# Altium schematic sheet PERIPHERALS.SchDoc
size A3; SheetNumber: 2; SheetTotal: 4
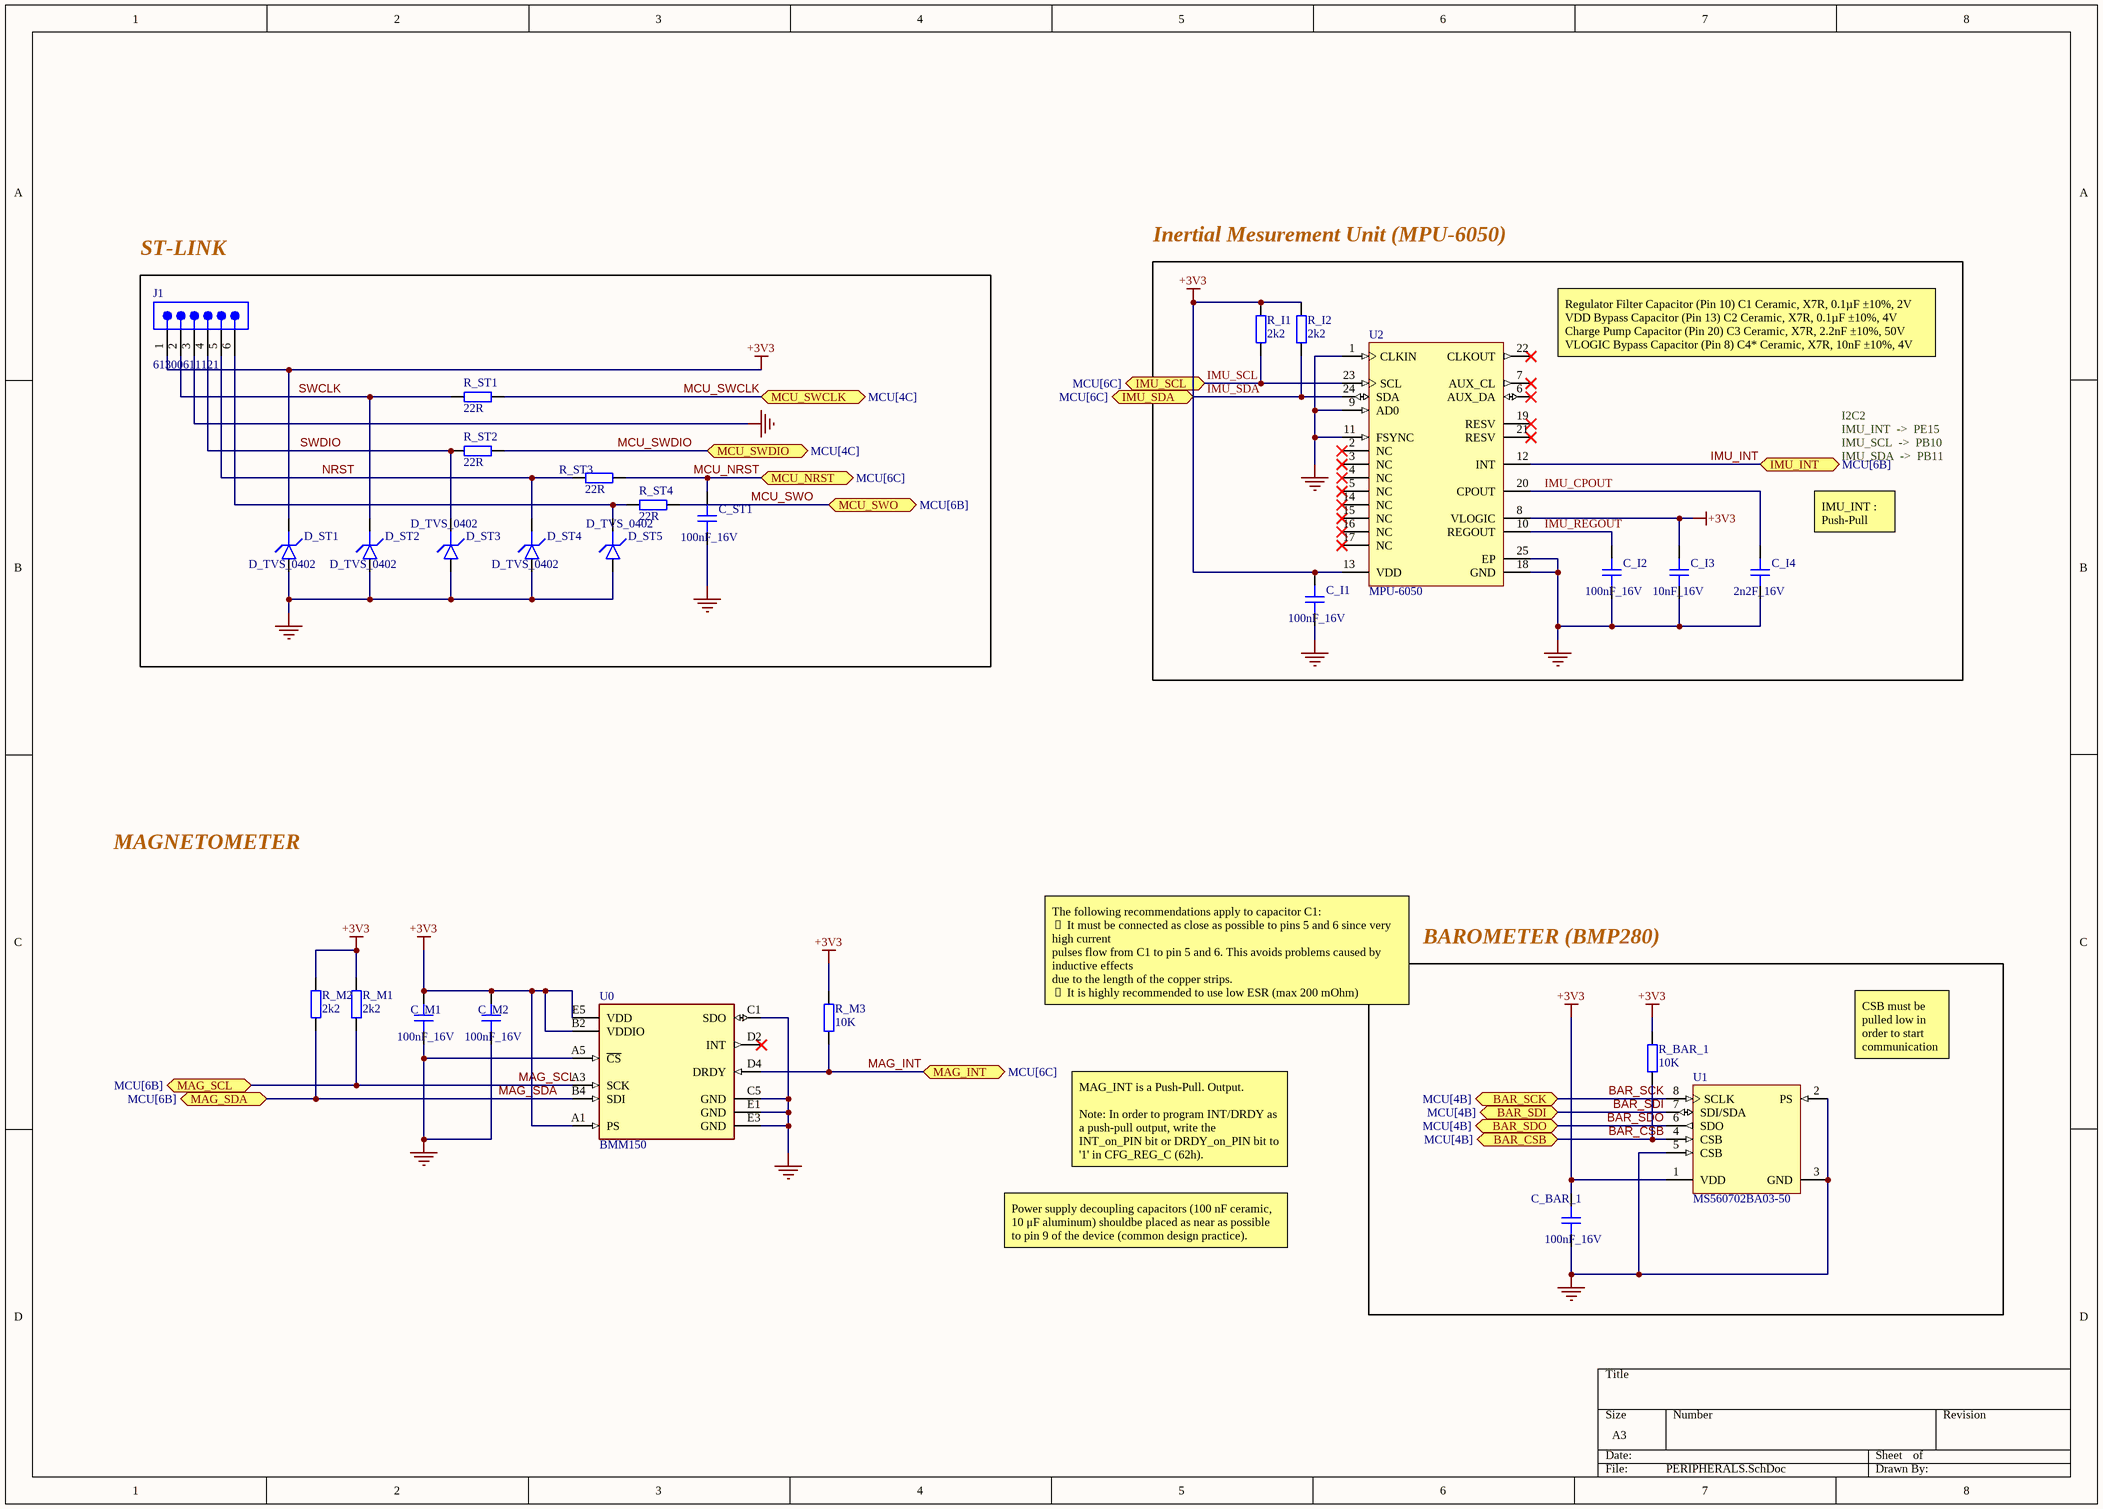
[diagram p0: PERIPHERALS.SchDoc]

## Parts
C_BAR_1  100nF_16V  [CAP_0402]
C_I1  100nF_16V  [CAP_0402]
C_I2  100nF_16V  [CAP_0402]
C_I3  10nF_16V  [CAP_0402]
C_I4  2n2F_16V  [CAP_0402]
C_M1  100nF_16V  [CAP_0402]
C_M2  100nF_16V  [CAP_0402]
C_ST1  100nF_16V  [CAP_0402]
D_ST1  D_TVS_0402  [D_0402]
D_ST2  D_TVS_0402  [D_0402]
D_ST3  D_TVS_0402  [D_0402]
D_ST4  D_TVS_0402  [D_0402]
D_ST5  D_TVS_0402  [D_0402]
J1  61300611121  [61300611121]
R_BAR_1  10K  [RES_0402]
R_I1  2k2  [RES_0402]
R_I2  2k2  [RES_0402]
R_M1  2k2  [RES_0402]
R_M2  2k2  [RES_0402]
R_M3  10K  [RES_0402]
R_ST1  22R  [RES_0402]
R_ST2  22R  [RES_0402]
R_ST3  22R  [RES_0402]
R_ST4  22R  [RES_0402]
U0  BMM150  [FP-BMM150-MFG]
U1  MS560702BA03-50  [TECO-MS560702BA03-50_V]
U2  MPU-6050  [IS-QFN-24_V]

## Blocks framed on the sheet
ST-LINK: C_ST1 D_ST1-D_ST5 J1 R_ST1-R_ST4
Inertial Mesurement Unit (MPU-6050): C_I1-C_I4 R_I1 R_I2 U2
BAROMETER (BMP280): C_BAR_1 R_BAR_1 U1

## Ports
BAR_CSB (bidir, see MCU[4B]), BAR_SCK (bidir, see MCU[4B]), BAR_SDI (bidir, see MCU[4B]), BAR_SDO (bidir, see MCU[4B]), IMU_INT (bidir, see MCU[6B]), IMU_SCL (bidir, see MCU[6C]), IMU_SDA (bidir, see MCU[6C]), MAG_INT (bidir, see MCU[6C]), MAG_SCL (bidir, see MCU[6B]), MAG_SDA (bidir, see MCU[6B]), MCU_NRST (bidir, see MCU[6C]), MCU_SWCLK (bidir, see MCU[4C]), MCU_SWDIO (bidir, see MCU[4C]), MCU_SWO (bidir, see MCU[6B])

## Nets
+3V3: C_BAR_1.2 C_I1.2 C_I3.2 C_M1.2 C_M2.2 D_ST1.K J1.1 R_BAR_1.1 R_I1.2 R_I2.2 R_M1.2 R_M2.2 R_M3.1 U0.A1(PS) U0.B2(VDDIO) U0.E5(VDD) U1.1(VDD) U2.8(VLOGIC) U2.13(VDD)
GND: C_BAR_1.1 C_I1.1 C_I2.1 C_I3.1 C_I4.1 C_M1.1 C_M2.1 C_ST1.1 D_ST1.A D_ST2.A D_ST3.A D_ST4.A D_ST5.A J1.3 U0.A5(~{CS}) U0.C1(SDO) U0.C5(GND) U0.E1(GND) U0.E3(GND) U1.2(PS) U1.3(GND) U1.5(CSB) U2.1(CLKIN) U2.9(AD0) U2.11(FSYNC) U2.18(GND) U2.25(EP)
BAR_CSB: R_BAR_1.2 U1.4(CSB) ; port BAR_CSB
BAR_SCK: U1.8(SCLK) ; port BAR_SCK
BAR_SDI: U1.7(SDI/SDA) ; port BAR_SDI
BAR_SDO: U1.6(SDO) ; port BAR_SDO
IMU_CPOUT: C_I4.2 U2.20(CPOUT)
IMU_INT: U2.12(INT) ; port IMU_INT
IMU_REGOUT: C_I2.2 U2.10(REGOUT)
IMU_SCL: R_I1.1 U2.23(SCL) ; port IMU_SCL
IMU_SDA: R_I2.1 U2.24(SDA) ; port IMU_SDA
MAG_INT: R_M3.2 U0.D4(DRDY) ; port MAG_INT
MAG_SCL: R_M1.1 U0.A3(SCK) ; port MAG_SCL
MAG_SDA: R_M2.1 U0.B4(SDI) ; port MAG_SDA
MCU_NRST: C_ST1.2 R_ST3.2 ; port MCU_NRST
MCU_SWCLK: R_ST1.2 ; port MCU_SWCLK
MCU_SWDIO: R_ST2.2 ; port MCU_SWDIO
MCU_SWO: R_ST4.2 ; port MCU_SWO
NRST: D_ST4.K J1.5 R_ST3.1
SWCLK: D_ST2.K J1.2 R_ST1.1
SWDIO: D_ST3.K J1.4 R_ST2.1
NetD_ST5_K: D_ST5.K J1.6 R_ST4.1

Not connected (* = marked no-connect by the designer): U0 D2(INT)*; U2 2(NC)* 3(NC)* 4(NC)* 5(NC)* 6(AUX_DA)* 7(AUX_CL)* 14(NC)* 15(NC)* 16(NC)* 17(NC)* 19(RESV)* 21(RESV)* 22(CLKOUT)*

## Notes on the sheet
- Regulator Filter Capacitor (Pin 10) C1 Ceramic, X7R, 0.1µF ±10%, 2V
  VDD Bypass Capacitor (Pin 13) C2 Ceramic, X7R, 0.1µF ±10%, 4V
  Charge Pump Capacitor (Pin 20) C3 Ceramic, X7R, 2.2nF ±10%, 50V
  VLOGIC Bypass Capacitor (Pin 8) C4* Ceramic, X7R, 10nF ±10%, 4V
- I2C2
- IMU_INT  ->  PE15
- IMU_SCL  ->  PB10
- IMU_SDA  ->  PB11
- IMU_INT : Push-Pull
- MAGNETOMETER
- The following recommendations apply to capacitor C1:
   It must be connected as close as possible to pins 5 and 6 since very high current
  pulses flow from C1 to pin 5 and 6. This avoids problems caused by inductive effects
  due to the length of the copper strips.
   It is highly recommended to use low ESR (max 200 mOhm)
- CSB must be pulled low in order to start communication
- MAG_INT is a Push-Pull. Output.
  Note: In order to program INT/DRDY as a push-pull output, write the INT_on_PIN bit or DRDY_on_PIN bit to '1' in CFG_REG_C (62h).
- Power supply decoupling capacitors (100 nF ceramic, 10 μF aluminum) shouldbe placed as near as possible to pin 9 of the device (common design practice).

## Library data of the parts
C_BAR_1 C_I1-C_I4 C_M1 C_M2 C_ST1 = CAP_0402: Capacitor SMD 0402; Manufacturer: *; Manufacturer Part Number: *; Distributor Link: *; LCSC: *; Rating: *; Dielectric: *
D_ST1-D_ST5 = D_TVS_0402: Diode TVS / ESD 0402
J1 = CMP-1502-01070-3: NexarPartId: 20084590; Current Rating: 3A; Pitch: 2.54mm; Gender: Male; Operating Supply Voltage: 250V; Connector Type: Male Pin; Number of Positions: 6; Contact Resistance: 20mΩ; Packaging: Bulk; Number of Pins: 6; Number of Rows: 1; Contact Plating: Gold; Lead Free: Lead Free; RoHS: Compliant; Contact Mating Length: 5.9944mm; Voltage Rating: 250V; REACH SVHC: Unknown; Contact Gender: Male; Housing Material: PBT; Min Operating Temperature: -40°C; Lead Pitch: 2.54mm; Mount: Through Hole; Number of Contacts: 6; Max Operating Temperature: 105°C; Contact Material: Copper; Orientation: Vertical; Termination: Through Hole; Color: Black; Height: 8.89mm
R_BAR_1 R_I1 R_I2 R_M1-R_M3 R_ST1-R_ST4 = RES_0402: Resistor SMD 0402; Manufacturer: *; Manufacturer Part Number: *; Distributor Link: *; LCSC: *
U0 = CMP-191063-000001-2: SENSOR FLIPCORE/HALL SPI 12WLCSP; Max Supply Current: 20mA; Operating Supply Voltage: 3.6V; Bandwidth: 10Hz; Axis: X, Y, Z; Resolution: 13b; Case/Package: SMD/SMT; Max Operating Temperature: 85°C; Min Operating Temperature: -40°C; Output Type: SPI; Packaging: Tape and Reel; Package Quantity: 10000
U1 = CMP-2000-07512-1: Barometric Pressure Sensor, with Stainless Steel Cap , 1.8 to 3.6 V, -40 to 85 degC, 8-Pin SMD, RoHS, Tape and Reel; Manufacturer: TE Connectivity; Lead Free: LeadFree; RoHSCompliant: false; Mounting Technology: SurfaceMount; Datasheet URL: http://www.te.com/commerce/DocumentDelivery/DDEController?Action=showdoc&DocId=Data+Sheet%7FMS5607-02BA03%7FB2%7Fpdf%7FEnglish%7FENG_DS_MS5607-02BA03_B2.pdf%7FMS560702BA03-50; Manufacturer URL: http://www.te.com/; Package Description: 8-Pin Surface Mount Device, Body 3 x 5 mm, Pitch 1.25 mm; Package Reference: MS560702BA03-50; Datasheet Version: 06/2017
U2 = CMP-1753-00002-2: 3-Axis Gyroscope, Accelerometer and a Digital Motion Processor(TM) (DMP), 2.375 to 3.46 V, -40 to 85 degC, 24-Pin QFN, RoHS, Tape and Reel; Manufacturer: InvenSense; Featured Product: MPU-60506-Axis,IntegratedI²CSolution; Other Names: 1428-1007-2 / MPU6050; Sensor Type: MotionTracking; Online Catalog: MPU-6000™Series; Unit PriceUSD: Digital; Datasheet Version: Rev. 3.3, 05/2012; Category: Sensors,Transducers; Datasheet URL: http://datasheet.octopart.com/MPU-6050-InvenSense-datasheet-14421344.pdf; Family: Multifunction; Standard Package: 5,000; Manufacturer URL: http://www.invensense.com/; Output Type: Digital; Dynamic Catalog: MPU-6000™Series